# EAGLE schematic exp-4_sche (EAGLE 9.6.2)
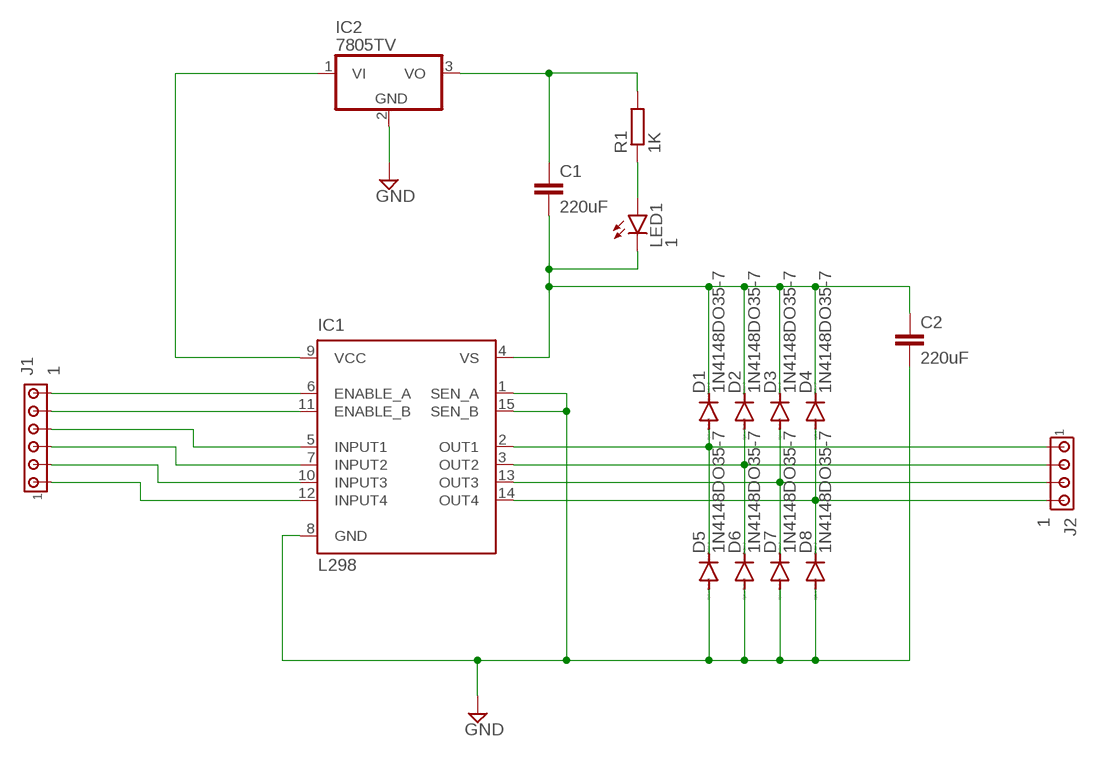
[diagram p0: schematic, sheet 1]

## Parts
C1  220uF  C2,5-3  [C2.5-3]
C2  220uF  C2,5-3  [C2.5-3]
D1  1N4148DO35-7  [DO35-7]
D2  1N4148DO35-7  [DO35-7]
D3  1N4148DO35-7  [DO35-7]
D4  1N4148DO35-7  [DO35-7]
D5  1N4148DO35-7  [DO35-7]
D6  1N4148DO35-7  [DO35-7]
D7  1N4148DO35-7  [DO35-7]
D8  1N4148DO35-7  [DO35-7]
IC1  L298  [MULTIWATT-15]
IC2  7805TV  [TO220V]
J1  1  MTA06-156  [1X6MTA]
J2  1  MTA04-156  [1X4MTA]
LED1  1  LED5MM  [LED5MM]
R1  1K  R-EU_0204/7  [0204/7]

## Nets
GND: C2.2 D5.A D6.A D7.A D8.A IC1.1(SEN_A) IC1.8(GND) IC1.15(SEN_B) IC2.2(GND)
N$1: IC1.9(VCC) IC2.1(VI)
N$2: C1.1 IC2.3(VO) R1.2
N$3: C1.2 C2.1 D1.C D2.C D3.C D4.C IC1.4(VS) LED1.K(C)
N$4: LED1.A R1.1
N$5: D1.A D5.C IC1.2(OUT1) J2.1
N$6: IC1.6(ENABLE_A) J1.6
N$7: IC1.11(ENABLE_B) J1.5
N$8: IC1.5(INPUT1) J1.4
N$9: IC1.7(INPUT2) J1.3
N$10: IC1.10(INPUT3) J1.2
N$11: IC1.12(INPUT4) J1.1
N$12: D2.A D6.C IC1.3(OUT2) J2.2
N$13: D3.A D7.C IC1.13(OUT3) J2.3
N$14: D4.A D8.C IC1.14(OUT4) J2.4

## Library data of the parts
C1 C2 = capacitor-wima:C: CAPACITOR naming: grid - package width
D1-D8 = diode:1N4148: DIODE high speed (Philips)
IC1 = st-microelectronics:L298: DUAL FULL-BRIDGE DRIVER; MPN: L298N; OC_FARNELL: 1589425; OC_NEWARK: 32M1527
IC2 = linear:78*: Positive VOLTAGE REGULATOR Source: http://cache.national.com/ds/LM/LM78L05.pdf http://www.fairchildsemi.com/ds/LM/LM7805.pdf
J1 = con-amp:MTA06-156: AMP connector
J2 = con-amp:MTA04-156: AMP connector
LED1 = led:LED: LED OSRAM: - CHIPLED LG R971, LG N971, LY N971, LG Q971, LY Q971, LO R971, LY R971 LH N974, LH R974 LS Q976, LO Q976, LY Q976 LO Q996 - Hyper CHIPLED LW Q18S LB Q993, LB Q99A, LB R99A - SideLED LS A670, LO A670, LY A670, LG A670, LP A670 LB A673, LV A673, LT A673, LW A673 LH A674 LY A675 LS A676, LA A676, LO A676, LY A676, LW A676 LS A679, LY A679, LG A679 - Hyper Micro SIDELED® LS Y876, LA Y876, LO Y876, LY Y876 LT Y87S - SmartLED LW L88C, LW L88S LB L89C, LB L89S, LG L890 LS L89K, LO L89K, LY L89K LS L896, LA L896, LO L896, LY L896 - TOPLED LS T670, LO T670, LY T670, LG T670, LP T670 LSG T670, LSP T670, LSY T670, LOP T670, LYG T670 LG T671, LOG T671, LSG T671 LB T673, LV T673, LT T673, LW T673 LH T674 LS T676, LA T676, LO T676, LY T676, LB T676, LH T676, LSB T676, LW T676 LB T67C, LV T67C, LT T67C, LS T67K, LO T67K, LY T67K, LW E67C LS E67B, LA E67B, LO E67B, LY E67B, LB E67C, LV E67C, LT E67C LW T67C LS T679, LY T679, LG T679 LS T770, LO T770, LY T770, LG T770, LP T770 LB T773, LV T773, LT T773, LW T773 LH T774 LS E675, LA E675, LY E675, LS T675 LS T776, LA T776, LO T776, LY T776, LB T776 LHGB T686 LT T68C, LB T68C - Hyper Mini TOPLED® LB M676 - Mini TOPLED Santana® LG M470 LS M47K, LO M47K, LY M47K Source: http://www.osram.convergy.de LUXEON: - LUMILED® LXK2-PW12-R00, LXK2-PW12-S00, LXK2-PW14-U00, LXK2-PW14-V00 LXK2-PM12-R00, LXK2-PM12-S00, LXK2-PM14-U00 LXK2-PE12-Q00, LXK2-PE12-R00, LXK2-PE12-S00, LXK2-PE14-T00, LXK2-PE14-U00 LXK2-PB12-K00, LXK2-PB12-L00, LXK2-PB12-M00, LXK2-PB14-N00, LXK2-PB14-P00, LXK2-PB14-Q00 LXK2-PR12-L00, LXK2-PR12-M00, LXK2-PR14-Q00, LXK2-PR14-R00 LXK2-PD12-Q00, LXK2-PD12-R00, LXK2-PD12-S00 LXK2-PH12-R00, LXK2-PH12-S00 LXK2-PL12-P00, LXK2-PL12-Q00, LXK2-PL12-R00 Source: www.luxeon.com KINGBRIGHT: KA-3528ASYC Source: www.kingbright.com
R1 = rcl:R-EU_: RESISTOR, European symbol; SPICEPREFIX: R